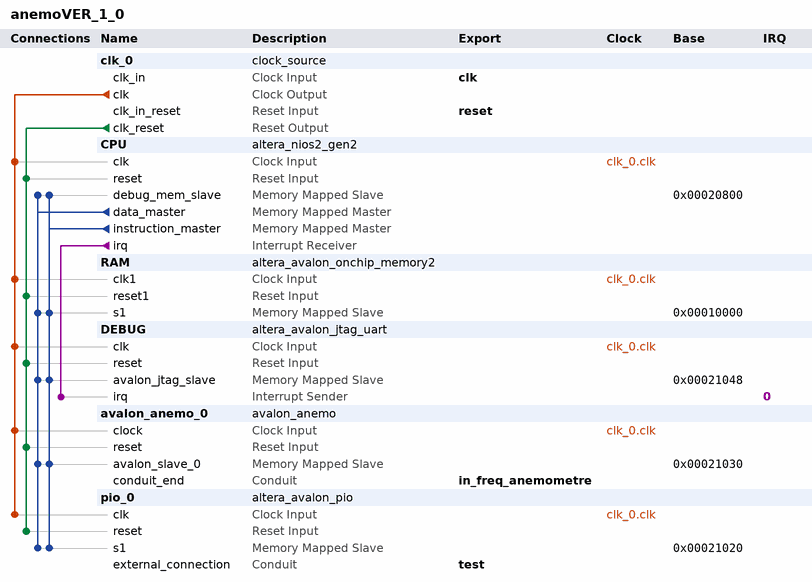
[diagram p0: system contents]
# Platform Designer (Qsys) system anemoVER_1_0, Cyclone IV E EP4CE22F17C6
# Parameters at their usual value, and those the tool derives, are not listed.
package require -exact qsys 18.1
create_system anemoVER_1_0
set_project_property DEVICE_FAMILY {Cyclone IV E}
set_project_property DEVICE EP4CE22F17C6

add_instance clk_0 clock_source 18.1
set_instance_parameter_value clk_0 clockFrequency 50000000

add_instance CPU altera_nios2_gen2 18.1
set_instance_parameter_value CPU dcache_size 2048
set_instance_parameter_value CPU exceptionSlave RAM.s1
set_instance_parameter_value CPU icache_size 4096
set_instance_parameter_value CPU impl Tiny
set_instance_parameter_value CPU resetSlave RAM.s1

add_instance RAM altera_avalon_onchip_memory2 18.1
set_instance_parameter_value RAM dataWidth 32
set_instance_parameter_value RAM dualPort false
set_instance_parameter_value RAM initMemContent true
set_instance_parameter_value RAM initializationFileName onchip_mem.hex
set_instance_parameter_value RAM memorySize 48000

add_instance DEBUG altera_avalon_jtag_uart 18.1
set_instance_parameter_value DEBUG simInteractiveOptions NO_INTERACTIVE_WINDOWS

add_instance avalon_anemo_0 avalon_anemo 1.0

add_instance pio_0 altera_avalon_pio 18.1
set_instance_parameter_value pio_0 direction Output
set_instance_parameter_value pio_0 width 8

# connections
add_connection clk_0.clk avalon_anemo_0.clock clock
add_connection clk_0.clk CPU.clk clock
add_connection clk_0.clk DEBUG.clk clock
add_connection clk_0.clk pio_0.clk clock
add_connection clk_0.clk RAM.clk1 clock
add_connection clk_0.clk_reset avalon_anemo_0.reset reset
add_connection clk_0.clk_reset CPU.reset reset
add_connection clk_0.clk_reset DEBUG.reset reset
add_connection clk_0.clk_reset pio_0.reset reset
add_connection clk_0.clk_reset RAM.reset1 reset
add_connection CPU.data_master avalon_anemo_0.avalon_slave_0 avalon
set_connection_parameter_value CPU.data_master/avalon_anemo_0.avalon_slave_0 baseAddress 0x00021030
add_connection CPU.data_master CPU.debug_mem_slave avalon
set_connection_parameter_value CPU.data_master/CPU.debug_mem_slave baseAddress 0x00020800
add_connection CPU.data_master DEBUG.avalon_jtag_slave avalon
set_connection_parameter_value CPU.data_master/DEBUG.avalon_jtag_slave baseAddress 0x00021048
add_connection CPU.data_master pio_0.s1 avalon
set_connection_parameter_value CPU.data_master/pio_0.s1 baseAddress 0x00021020
add_connection CPU.data_master RAM.s1 avalon
set_connection_parameter_value CPU.data_master/RAM.s1 baseAddress 0x00010000
add_connection CPU.instruction_master avalon_anemo_0.avalon_slave_0 avalon
set_connection_parameter_value CPU.instruction_master/avalon_anemo_0.avalon_slave_0 baseAddress 0x00021030
add_connection CPU.instruction_master CPU.debug_mem_slave avalon
set_connection_parameter_value CPU.instruction_master/CPU.debug_mem_slave baseAddress 0x00020800
add_connection CPU.instruction_master DEBUG.avalon_jtag_slave avalon
set_connection_parameter_value CPU.instruction_master/DEBUG.avalon_jtag_slave baseAddress 0x00021048
add_connection CPU.instruction_master pio_0.s1 avalon
set_connection_parameter_value CPU.instruction_master/pio_0.s1 baseAddress 0x00021020
add_connection CPU.instruction_master RAM.s1 avalon
set_connection_parameter_value CPU.instruction_master/RAM.s1 baseAddress 0x00010000
add_connection CPU.irq DEBUG.irq interrupt
set_connection_parameter_value CPU.irq/DEBUG.irq irqNumber 0

# exported interfaces
add_interface clk clock sink
set_interface_property clk EXPORT_OF clk_0.clk_in
add_interface in_freq_anemometre conduit end
set_interface_property in_freq_anemometre EXPORT_OF avalon_anemo_0.conduit_end
add_interface reset reset sink
set_interface_property reset EXPORT_OF clk_0.clk_in_reset
add_interface test conduit end
set_interface_property test EXPORT_OF pio_0.external_connection

set_interconnect_requirement {$system} qsys_mm.clockCrossingAdapter HANDSHAKE
set_interconnect_requirement {$system} qsys_mm.enableEccProtection FALSE
set_interconnect_requirement {$system} qsys_mm.insertDefaultSlave FALSE
set_interconnect_requirement {$system} qsys_mm.maxAdditionalLatency 1

save_system anemoVER_1_0.qsys
